# Altium schematic sheet Molex_Conn.SchDoc
size A4; SheetNumber: 6; SheetTotal: 6
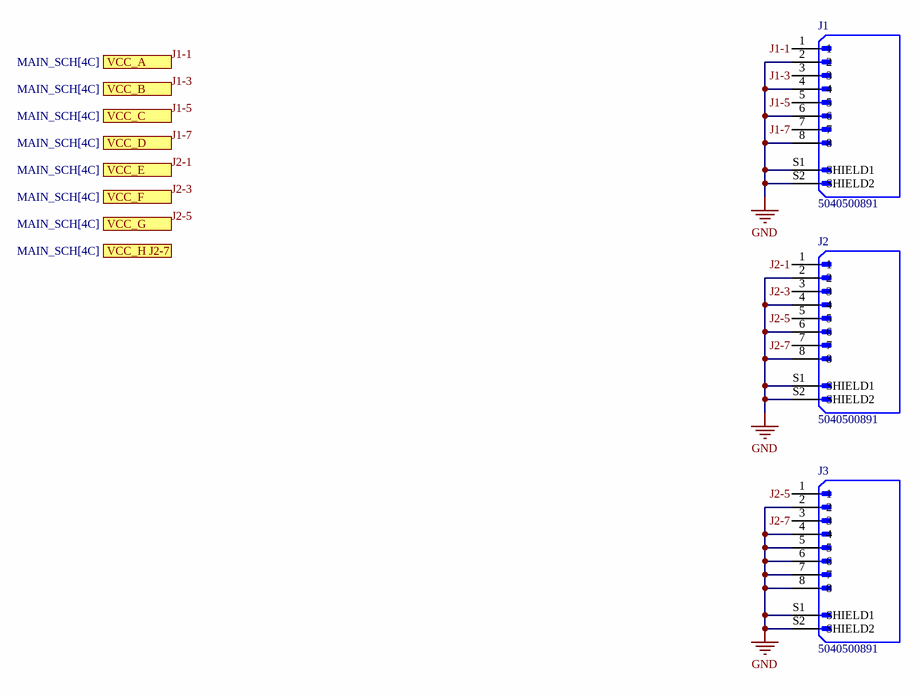
[diagram p0: Molex_Conn.SchDoc]

## Parts
J1  5040500891  [MOLEX_5040500891]
J2  5040500891  [MOLEX_5040500891]
J3  5040500891  [MOLEX_5040500891]

## Ports
VCC_A (in, see MAIN_SCH[4C]), VCC_B (in, see MAIN_SCH[4C]), VCC_C (in, see MAIN_SCH[4C]), VCC_D (in, see MAIN_SCH[4C]), VCC_E (in, see MAIN_SCH[4C]), VCC_F (in, see MAIN_SCH[4C]), VCC_G (in, see MAIN_SCH[4C]), VCC_H (in, see MAIN_SCH[4C])

## Nets
GND: J1.2 J1.4 J1.6 J1.8 J1.S1(SHIELD1) J1.S2(SHIELD2) J2.2 J2.4 J2.6 J2.8 J2.S1(SHIELD1) J2.S2(SHIELD2) J3.2 J3.4 J3.5 J3.6 J3.7 J3.8 J3.S1(SHIELD1) J3.S2(SHIELD2)
J1-1: J1.1 ; port VCC_A
J1-3: J1.3 ; port VCC_B
J1-5: J1.5 ; port VCC_C
J1-7: J1.7 ; port VCC_D
J2-1: J2.1 ; port VCC_E
J2-3: J2.3 ; port VCC_F
J2-5: J2.5 J3.1 ; port VCC_G
J2-7: J2.7 J3.3 ; port VCC_H

## Notes on the sheet
- Title
- Size:
- Date:
- A4
- Designer:
- Time:
- Sheet
- Revision:
- of
- University of Stuttgart
- ILH
- Pfaffenwaldring 47
- 70569 Stuttgart
- Germany
- File:

## Library data of the parts
J1-J3 = 5040500891: Value: *; Availability: Unavailable; Price: None; MP: 5040500891; Package: None